# Altium schematic sheet dac.SchDoc: =GlobalProjectName
size 209 x 297 mm; ApprovedBy: Утвердил; CheckedBy: Проверил; Author: Разработал; SheetNumber: 6; SheetTotal: 9; PageSetup: Record=PageOptions|CenterHorizontal=True|CenterVertical=True|PrintScale=1.00|XCorrection=1.00|YCorrection=1.00|PrintKind=1|BorderSize=5000000|LeftOffset=0|BottomOffset=0|Orientation=2|PaperLength=1000|PaperWidth=1000|Scale=100|PaperSource=15|PrintQuality=1200|MediaType=1|DitherType=10|PaperKind=A3|PrintScaleMode=1; Weight: -; ScaleFactor: -; NormInspection: Норм.Контр.
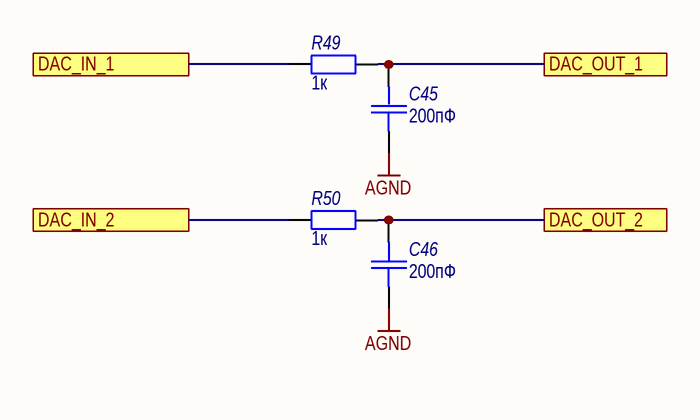
[diagram p0: dac.SchDoc]

## Parts
C45  200пФ  [SMD_0805]
C46  200пФ  [SMD_0805]
R49  1к  [SMD_0603]
R50  1к  [SMD_0603]

## Ports
DAC_IN_1, DAC_IN_2, DAC_OUT_1, DAC_OUT_2

## Nets
AGND: C45.1 C46.1
DAC_IN_1: R49.1 ; port DAC_IN_1
DAC_IN_2: R50.1 ; port DAC_IN_2
DAC_OUT_1: C45.2 R49.2 ; port DAC_OUT_1
DAC_OUT_2: C46.2 R50.2 ; port DAC_OUT_2

## Notes on the sheet
- Подп. и дата
- Инв. № дубл.
- Взам. инв. №
- Инв. № подл.
- Изм.
- Лист
- № докум.
- Подп.
- Дата
- Форма 2а ГОСТ 2.104-2006
- Копировал
- Формат А4

## Library data of the parts
C45 C46 = Capacitor: Назначение: SMD-конденсатор; Наименование: Конденсатор; Потребление, Вт: 0; Value: 0,1мкФ
R49 R50 = Resistor: Наименование: Резистор; Назначение: SMD-резистор; Потребление, Вт: 0,001; Value: 1к